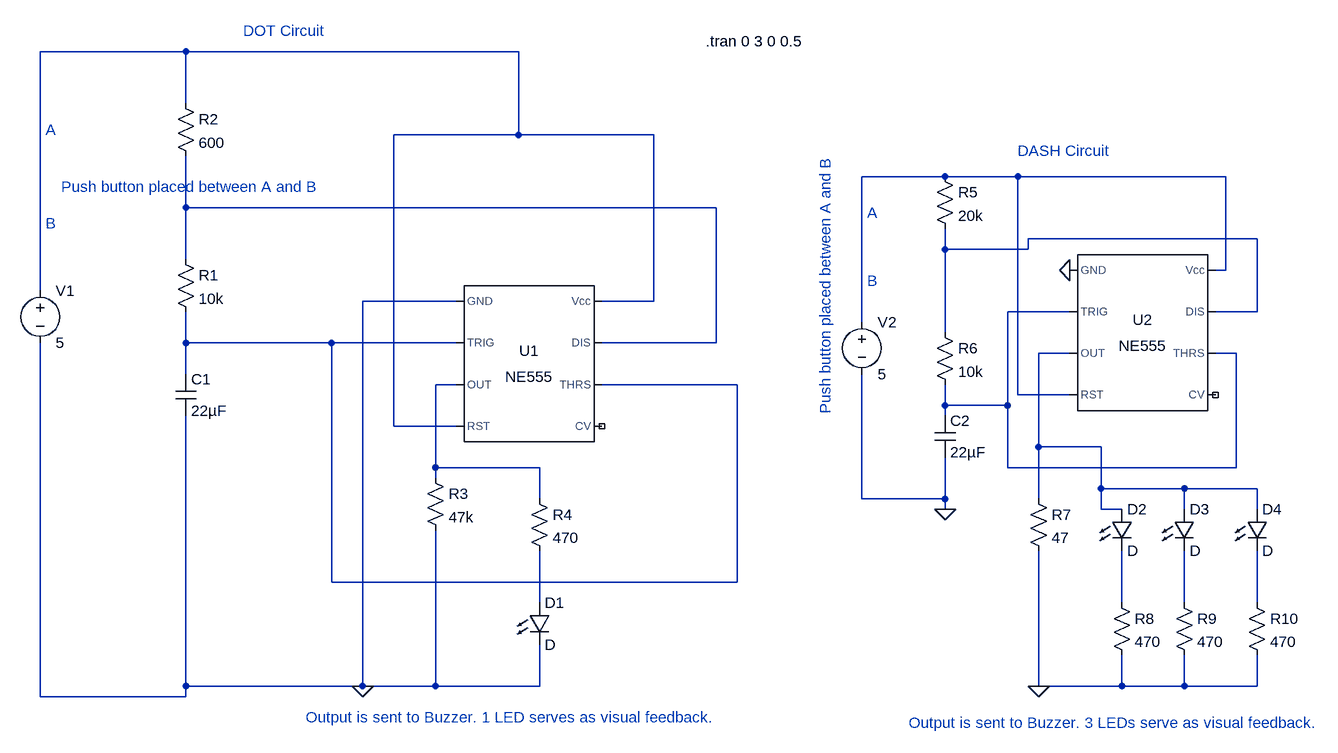
[diagram p0: schematic IED_MiniProj_Circuit.asc]
IED_MiniProj_Circuit.asc, the LTspice schematic file:
Version 4
SHEET 1 1544 680
WIRE -352 -368 -576 -368
WIRE 160 -368 -352 -368
WIRE -352 -288 -352 -368
WIRE 160 -240 160 -368
WIRE 160 -240 -32 -240
WIRE 368 -240 160 -240
WIRE 816 -176 688 -176
WIRE 928 -176 816 -176
WIRE 1248 -176 928 -176
WIRE -352 -128 -352 -208
WIRE 464 -128 -352 -128
WIRE 1296 -80 944 -80
WIRE 816 -64 816 -96
WIRE 944 -64 944 -80
WIRE 944 -64 816 -64
WIRE -352 -48 -352 -128
WIRE 1248 -32 1248 -176
WIRE 1248 -32 1232 -32
WIRE -576 0 -576 -368
WIRE 64 16 -80 16
WIRE 368 16 368 -240
WIRE 368 16 288 16
WIRE 1008 32 912 32
WIRE 1296 32 1296 -80
WIRE 1296 32 1232 32
WIRE 688 48 688 -176
WIRE 816 64 816 -64
WIRE -352 80 -352 32
WIRE -128 80 -352 80
WIRE 64 80 -128 80
WIRE 464 80 464 -128
WIRE 464 80 288 80
WIRE 1008 96 960 96
WIRE 1264 96 1232 96
WIRE -352 128 -352 80
WIRE 64 144 32 144
WIRE 496 144 288 144
WIRE 928 160 928 -176
WIRE 1008 160 928 160
WIRE 816 176 816 144
WIRE 912 176 912 32
WIRE 912 176 816 176
WIRE 816 192 816 176
WIRE -32 208 -32 -240
WIRE 64 208 -32 208
WIRE 960 240 960 96
WIRE 1056 240 960 240
WIRE 32 272 32 144
WIRE 192 272 32 272
WIRE 912 272 912 176
WIRE 1264 272 1264 96
WIRE 1264 272 912 272
WIRE 32 288 32 272
WIRE 1056 304 1056 240
WIRE 1184 304 1056 304
WIRE 1296 304 1184 304
WIRE 192 320 192 272
WIRE 688 320 688 128
WIRE 816 320 816 256
WIRE 816 320 688 320
WIRE 960 320 960 240
WIRE 816 336 816 320
WIRE 1056 336 1056 304
WIRE 1088 336 1056 336
WIRE 1184 336 1184 304
WIRE 1296 336 1296 304
WIRE -128 448 -128 80
WIRE 496 448 496 144
WIRE 496 448 -128 448
WIRE 192 480 192 400
WIRE 1088 480 1088 400
WIRE 1184 480 1184 400
WIRE 1296 480 1296 400
WIRE -352 608 -352 192
WIRE -80 608 -80 16
WIRE -80 608 -352 608
WIRE 32 608 32 368
WIRE 32 608 -80 608
WIRE 192 608 192 544
WIRE 192 608 32 608
WIRE 960 608 960 400
WIRE 1088 608 1088 560
WIRE 1088 608 960 608
WIRE 1184 608 1184 560
WIRE 1184 608 1088 608
WIRE 1296 608 1296 560
WIRE 1296 608 1184 608
WIRE -576 624 -576 80
WIRE -352 624 -352 608
WIRE -352 624 -576 624
FLAG -80 608 0
FLAG 1008 -32 0
FLAG 816 336 0
FLAG 960 608 0
DATAFLAG 288 -240 ""
SYMBOL Misc\\NE555 176 112 R0
SYMATTR InstName U1
SYMBOL cap -368 128 R0
SYMATTR InstName C1
SYMATTR Value 22µF
SYMBOL res -368 -64 R0
SYMATTR InstName R1
SYMATTR Value 10k
SYMBOL res -368 -304 R0
SYMATTR InstName R2
SYMATTR Value 600
SYMBOL voltage -576 -16 R0
WINDOW 123 0 0 Left 0
WINDOW 39 0 0 Left 0
SYMATTR InstName V1
SYMATTR Value 5
SYMBOL voltage 688 32 R0
WINDOW 123 0 0 Left 0
WINDOW 39 0 0 Left 0
SYMATTR InstName V2
SYMATTR Value 5
SYMBOL Misc\\NE555 1120 64 R0
SYMATTR InstName U2
SYMBOL res 800 -192 R0
SYMATTR InstName R5
SYMATTR Value 20k
SYMBOL res 800 48 R0
SYMATTR InstName R6
SYMATTR Value 10k
SYMBOL cap 800 192 R0
SYMATTR InstName C2
SYMATTR Value 22µF
SYMBOL res 944 304 R0
SYMATTR InstName R7
SYMATTR Value 47
SYMBOL res 16 272 R0
SYMATTR InstName R3
SYMATTR Value 47k
SYMBOL LED 176 480 R0
SYMATTR InstName D1
SYMBOL LED 1072 336 R0
SYMATTR InstName D2
SYMBOL LED 1168 336 R0
SYMATTR InstName D3
SYMBOL LED 1280 336 R0
SYMATTR InstName D4
SYMBOL res 176 304 R0
SYMATTR InstName R4
SYMATTR Value 470
SYMBOL res 1072 464 R0
SYMATTR InstName R8
SYMATTR Value 470
SYMBOL res 1168 464 R0
SYMATTR InstName R9
SYMATTR Value 470
SYMBOL res 1280 464 R0
SYMATTR InstName R10
SYMATTR Value 470
TEXT 448 -384 Left 2 !.tran 0 3 0 0.5
TEXT -264 -400 Left 2 ;DOT Circuit
TEXT 928 -216 Left 2 ;DASH Circuit
TEXT -568 -248 Left 2 ;A
TEXT -568 -104 Left 2 ;B
TEXT -544 -160 Left 2 ;Push button placed between A and B
TEXT 696 -120 Left 2 ;A
TEXT 696 -16 Left 2 ;B
TEXT 632 -208 VRight 2 ;Push button placed between A and B
TEXT 760 664 Left 2 ;Output is sent to Buzzer. 3 LEDs serve as visual feedback.
TEXT -168 656 Left 2 ;Output is sent to Buzzer. 1 LED serves as visual feedback.

The netlist it stands for:
* IED_MiniProj_Circuit.asc
XU1 0 N006 N008 N001 NC_01 N006 N003 N001 NE555  ; pins GND TRIG OUT RST CV THRS DIS Vcc
C1 N006 0 22µF
R1 N003 N006 10k
R2 N001 N003 600
V1 N001 0 5
V2 N002 0 5
XU2 0 N005 N007 N002 NC_02 N005 N004 N002 NE555  ; pins GND TRIG OUT RST CV THRS DIS Vcc
R5 N002 N004 20k
R6 N004 N005 10k
C2 N005 0 22µF
R7 N007 0 47
R3 N008 0 47k
D1 N009 0 D
D2 N007 N010 D
D3 N007 N011 D
D4 N007 N012 D
R4 N008 N009 470
R8 N010 0 470
R9 N011 0 470
R10 N012 0 470
.model D D
.lib standard.dio
.tran 0 3 0 0.5
* DOT Circuit
* DASH Circuit
* A
* B
* Push button placed between A and B
* A
* B
* Push button placed between A and B
* Output is sent to Buzzer. 3 LEDs serve as visual feedback.
* Output is sent to Buzzer. 1 LED serves as visual feedback.
.lib NE555.sub
.backanno
.end